# Altium project Badge.PrjPCB
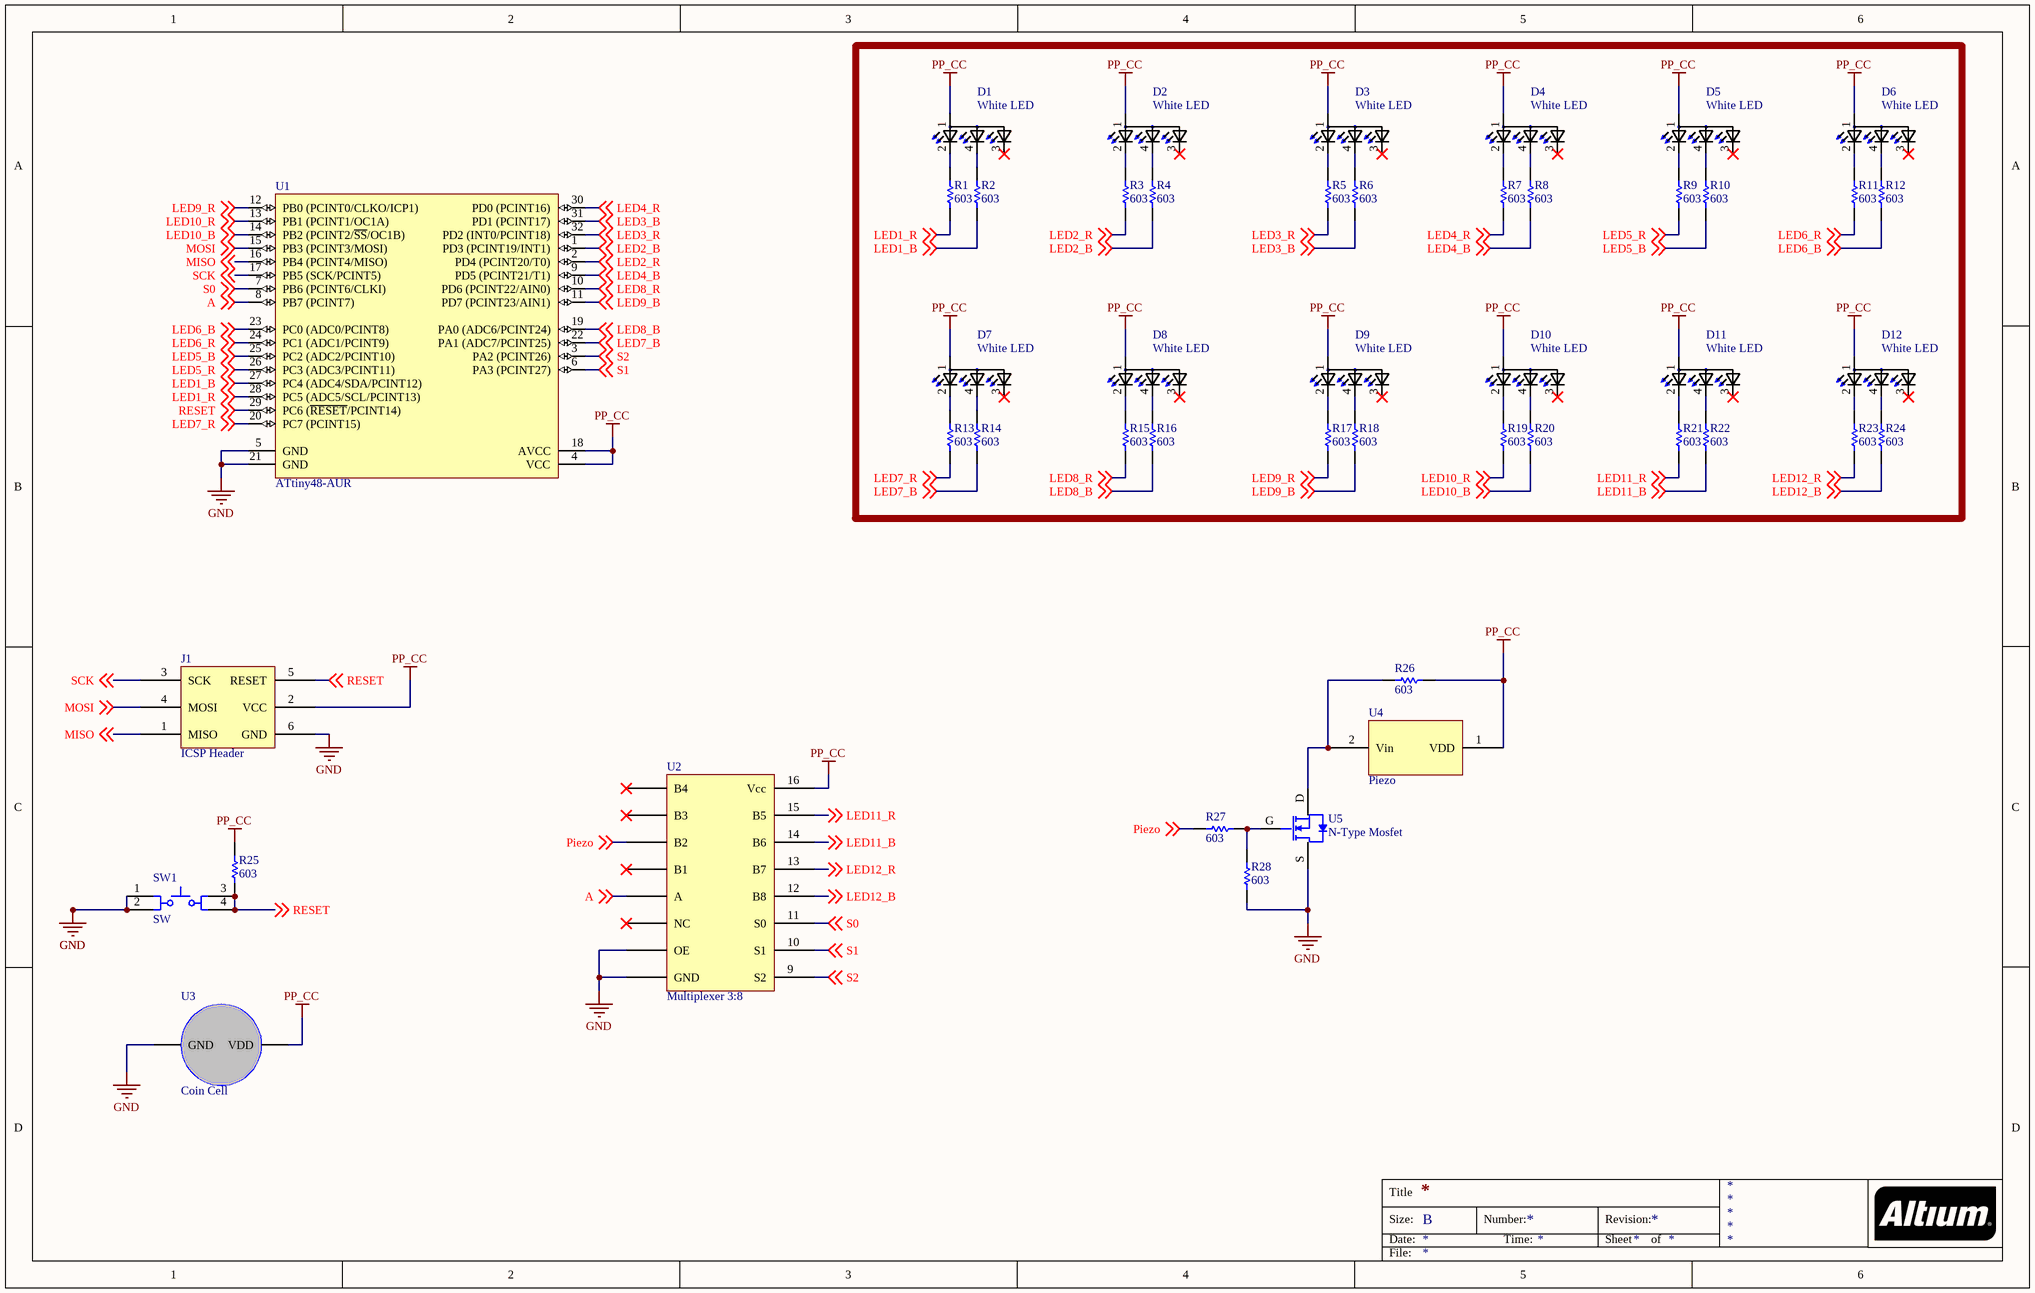
[diagram p0: Badge.SchDoc]
1 sheet, 47 parts. Net scope: global (net labels, ports and power ports of the same name join across sheets).
Board file: Badge.PcbDoc

## Sheet Badge.SchDoc
size B

### Parts
D1  White LED  [*LED_ASMB-KTF0-0A306]
D2  White LED  [*LED_ASMB-KTF0-0A306]
D3  White LED  [*LED_ASMB-KTF0-0A306]
D4  White LED  [*LED_ASMB-KTF0-0A306]
D5  White LED  [*LED_ASMB-KTF0-0A306]
D6  White LED  [*LED_ASMB-KTF0-0A306]
D7  White LED  [*LED_ASMB-KTF0-0A306]
D8  White LED  [*LED_ASMB-KTF0-0A306]
D9  White LED  [*LED_ASMB-KTF0-0A306]
D10  White LED  [*LED_ASMB-KTF0-0A306]
D11  White LED  [*LED_ASMB-KTF0-0A306]
D12  White LED  [*LED_ASMB-KTF0-0A306]
J1  ICSP Header  [programmer header]
R1  603  [RESC0603(1608)_L]
R2  603  [RESC0603(1608)_L]
R3  603  [RESC0603(1608)_L]
R4  603  [RESC0603(1608)_L]
R5  603  [RESC0603(1608)_L]
R6  603  [RESC0603(1608)_L]
R7  603  [RESC0603(1608)_L]
R8  603  [RESC0603(1608)_L]
R9  603  [RESC0603(1608)_L]
R10  603  [RESC0603(1608)_L]
R11  603  [RESC0603(1608)_L]
R12  603  [RESC0603(1608)_L]
R13  603  [RESC0603(1608)_L]
R14  603  [RESC0603(1608)_L]
R15  603  [RESC0603(1608)_L]
R16  603  [RESC0603(1608)_L]
R17  603  [RESC0603(1608)_L]
R18  603  [RESC0603(1608)_L]
R19  603  [RESC0603(1608)_L]
R20  603  [RESC0603(1608)_L]
R21  603  [RESC0603(1608)_L]
R22  603  [RESC0603(1608)_L]
R23  603  [RESC0603(1608)_L]
R24  603  [RESC0603(1608)_L]
R25  603  [RESC1608X50X30LL20T20]
R26  603  [RESC1608X50X30LL20T20]
R27  603  [RESC1608X50X30LL20T20]
R28  603  [RESC1608X50X30LL20T20]
SW1  SW  [CKCP-PTS645S_V]
U1  ATtiny48-AUR  [32A_N]
U2  Multiplexer 3:8  [Multiplexer]
U3  Coin Cell  [Batt]
U4  Piezo  [Piezo]
U5  N-Type Mosfet  [2N7002K-7]

### Nets
GND: J1.6(GND) R28.2 SW1.1 SW1.2 U1.5(GND) U1.21(GND) U2.7(OE) U2.8(GND) U3.GND U5.S(SOURCE)
PP_CC: D1.1(A) D2.1(A) D3.1(A) D4.1(A) D5.1(A) D6.1(A) D7.1(A) D8.1(A) D9.1(A) D10.1(A) D11.1(A) D12.1(A) J1.2(VCC) R25.2 R26.1 U1.4(VCC) U1.18(AVCC) U2.16(Vcc) U3.VDD U4.1(VDD)
A: U1.8(PB7_(PCINT7)) U2.5(A) ; off-sheet A
LED1_B: R2.1 U1.27(PC4_(ADC4/SDA/PCINT12)) ; off-sheet LED1_B
LED1_R: R1.1 U1.28(PC5_(ADC5/SCL/PCINT13)) ; off-sheet LED1_R
LED2_B: R4.1 U1.1(PD3_(PCINT19/INT1)) ; off-sheet LED2_B
LED2_R: R3.1 U1.2(PD4_(PCINT20/T0)) ; off-sheet LED2_R
LED3_B: R6.1 U1.31(PD1_(PCINT17)) ; off-sheet LED3_B
LED3_R: R5.1 U1.32(PD2_(INT0/PCINT18)) ; off-sheet LED3_R
LED4_B: R8.1 U1.9(PD5_(PCINT21/T1)) ; off-sheet LED4_B
LED4_R: R7.1 U1.30(PD0_(PCINT16)) ; off-sheet LED4_R
LED5_B: R10.1 U1.25(PC2_(ADC2/PCINT10)) ; off-sheet LED5_B
LED5_R: R9.1 U1.26(PC3_(ADC3/PCINT11)) ; off-sheet LED5_R
LED6_B: R12.1 U1.23(PC0_(ADC0/PCINT8)) ; off-sheet LED6_B
LED6_R: R11.1 U1.24(PC1_(ADC1/PCINT9)) ; off-sheet LED6_R
LED7_B: R14.1 U1.22(PA1_(ADC7/PCINT25)) ; off-sheet LED7_B
LED7_R: R13.1 U1.20(PC7_(PCINT15)) ; off-sheet LED7_R
LED8_B: R16.1 U1.19(PA0_(ADC6/PCINT24)) ; off-sheet LED8_B
LED8_R: R15.1 U1.10(PD6_(PCINT22/AIN0)) ; off-sheet LED8_R
LED9_B: R18.1 U1.11(PD7_(PCINT23/AIN1)) ; off-sheet LED9_B
LED9_R: R17.1 U1.12(PB0_(PCINT0/CLKO/ICP1)) ; off-sheet LED9_R
LED10_B: R20.1 U1.14(PB2_(PCINT2/~{SS}/OC1B)) ; off-sheet LED10_B
LED10_R: R19.1 U1.13(PB1_(PCINT1/OC1A)) ; off-sheet LED10_R
LED11_B: R22.1 U2.14(B6) ; off-sheet LED11_B
LED11_R: R21.1 U2.15(B5) ; off-sheet LED11_R
LED12_B: R24.1 U2.12(B8) ; off-sheet LED12_B
LED12_R: R23.1 U2.13(B7) ; off-sheet LED12_R
MISO: J1.1(MISO) U1.16(PB4_(PCINT4/MISO)) ; off-sheet MISO
MOSI: J1.4(MOSI) U1.15(PB3_(PCINT3/MOSI)) ; off-sheet MOSI
Piezo: R27.2 U2.3(B2) ; off-sheet Piezo
RESET: J1.5(RESET) R25.1 SW1.3 SW1.4 U1.29(PC6_(~{RESET}/PCINT14)) ; off-sheet RESET
S0: U1.7(PB6_(PCINT6/CLKI)) U2.11(S0) ; off-sheet S0
S1: U1.6(PA3_(PCINT27)) U2.10(S1) ; off-sheet S1
S2: U1.3(PA2_(PCINT26)) U2.9(S2) ; off-sheet S2
SCK: J1.3(SCK) U1.17(PB5_(SCK/PCINT5)) ; off-sheet SCK
NetD1_2: D1.2(CRED) R1.2
NetD1_4: D1.4(CBLUE) R2.2
NetD2_2: D2.2(CRED) R3.2
NetD2_4: D2.4(CBLUE) R4.2
NetD3_2: D3.2(CRED) R5.2
NetD3_4: D3.4(CBLUE) R6.2
NetD4_2: D4.2(CRED) R7.2
NetD4_4: D4.4(CBLUE) R8.2
NetD5_2: D5.2(CRED) R9.2
NetD5_4: D5.4(CBLUE) R10.2
NetD6_2: D6.2(CRED) R11.2
NetD6_4: D6.4(CBLUE) R12.2
NetD7_2: D7.2(CRED) R13.2
NetD7_4: D7.4(CBLUE) R14.2
NetD8_2: D8.2(CRED) R15.2
NetD8_4: D8.4(CBLUE) R16.2
NetD9_2: D9.2(CRED) R17.2
NetD9_4: D9.4(CBLUE) R18.2
NetD10_2: D10.2(CRED) R19.2
NetD10_4: D10.4(CBLUE) R20.2
NetD11_2: D11.2(CRED) R21.2
NetD11_4: D11.4(CBLUE) R22.2
NetD12_2: D12.2(CRED) R23.2
NetD12_4: D12.4(CBLUE) R24.2
NetR26_2: R26.2 U4.2(Vin) U5.D(DRAIN)
NetR27_1: R27.1 R28.1 U5.G(GATE)

Not connected (* = marked no-connect by the designer): D1 3(CGREEN)*; D2 3(CGREEN)*; D3 3(CGREEN)*; D4 3(CGREEN)*; D5 3(CGREEN)*; D6 3(CGREEN)*; D7 3(CGREEN)*; D8 3(CGREEN)*; D9 3(CGREEN)*; D10 3(CGREEN)*; D11 3(CGREEN)*; D12 3(CGREEN)*; U2 1(B4)* 2(B3)* 4(B1)* 6(NC)*

### Notes on the sheet
- Title
- Size:
- Date:
- B
- Number:
- Time:
- Revision:
- Sheet
- of
- File:

### Library data of the parts
D1-D12 = ASMB-KTF0-0A306: 2220 Tricolor PLCC4 Surface Mount LED; MF: Broadcom Limited; Digi-Key_Purchase_URL: https://www.digikey.com/product-detail/en/broadcom-limited/ASMB-KTF0-0A306/516-3906-1-ND/7917025?utm_source=snapeda&utm_medium=aggregator&utm_campaign=symbol; Digi-Key_Part_Number: 516-3906-1-ND; MP: ASMB-KTF0-0A306; Package: PLCC-4 Broadcom; SnapEDA_Link: https://www.snapeda.com/parts/ASMB-KTF0-0A306/Broadcom%20Limited/view-part/?ref=snap; Value: *
R1-R24 = CMP-1012-00062-1: 330R 0.1W 5% 0603 (1608 Metric)  SMD; MPN: RR0816P-331-D; Manufacturer: Susumu; Value: 330.00 Ohm; Case-EIA: 0603; Case-Metric: 1608; Tolerance: 5 %; Power: 0.1 W; Technology: SMT
R25-R28 = CMP-2000-02424-1: MPN: RR0816P-103-D; Manufacturer: Susumu
SW1 = CMP-2000-07594-1: Tact Switch, SPST-NO, 50 mA, -20 to 60 degC, 4-Pin SMD, RoHS, Tape and Reel; MPN: PTS645S; Manufacturer: C&K Components; Actuator Length: 0.85mm; Voltage Rating (DC): 12V; Mechanical Life: 100000Cycles; Illumination Type: Illuminated; Throw Configuration: SPST; Switch Function: Off-Mom; Actuator Material: Polyamide; Contact Resistance: 100mOhm; Max Current Rating: 50mA; Operating Force: 160gf; Case\/Package: SMD/SMT; Orientation: Straight; RoHSCompliant: True; Manufacturer URL: http://www.ckswitches.com/; Package Quantity: 1000; Datasheet URL: http://www.ckswitches.com/media/1471/pts645.pdf; Colour: Black; Min Operating Temperature: -20degC; Length: 6mm; Mount: SurfaceMount; Depth: 9mm; Max Voltage Rating (DC): 12V; REACH SVHC: NoSVHC; Contact Material: Silver; Packaging: TapeandReel; Package Description: 4-Pin Surface Mount Device, Body 6 x 6 mm, Pitch 4.5 mm; Max Operating Temperature: 60degC; Lead Free: LeadFree; Termination: GullWing; Current Rating: 50mA; Datasheet Version: 04/2016; Mounting Technology: SurfaceMount; Contact Plating: Silver
U1 = CMP-0093-00123-1: 8-bit AVR Microcontroller, 1.8-5.5V, 4KB Flash, 64 Bytes EEPROM, 256 Bytes SRAM, 32-pin TQFP, Industrial Grade (-40°C to 85°C), Pb-Free, Reel; PackageDescription: 32-Lead, 7x7x1.0 mm Body, 0.8mm Lead Pitch, Thin Profile Plastic Quad Flat Package (TQFP); Code_JEDEC: MS-026-ABA; PackageReference: 32A; PackageVersion: revB, Oct-2001; DatasheetVersion: revC, Mar-2009
U2 = Multiplexer: IC LV FET MUX/DEMUX 16-TSSOP; Manufacturer: TI; MPN: SN74CBTLV3251PWR; Value: Multiplexer 3:8
U3 = Batt: Battery Retainer Coin, 20.0mm 1 Cell SMD (SMT) Tab; MPN: 3034TR; Manufacturer: Keystone Electronics; Value: Coin Cell
U4 = Piezo: AUDIO PIEZO TRANSDUCER 30V TH; MPN: PS1240P02BT; Manufacturer: TDK Corporation; Value: Piezo
U5 = 2N7002K-7: N-Channel 800V 1A (Tc) 45W (Tc) Surface Mount D-Pak; Manufacturer: Diodes Incorporated; MPN: 2N7002K-7; Value: N-Type Mosfet